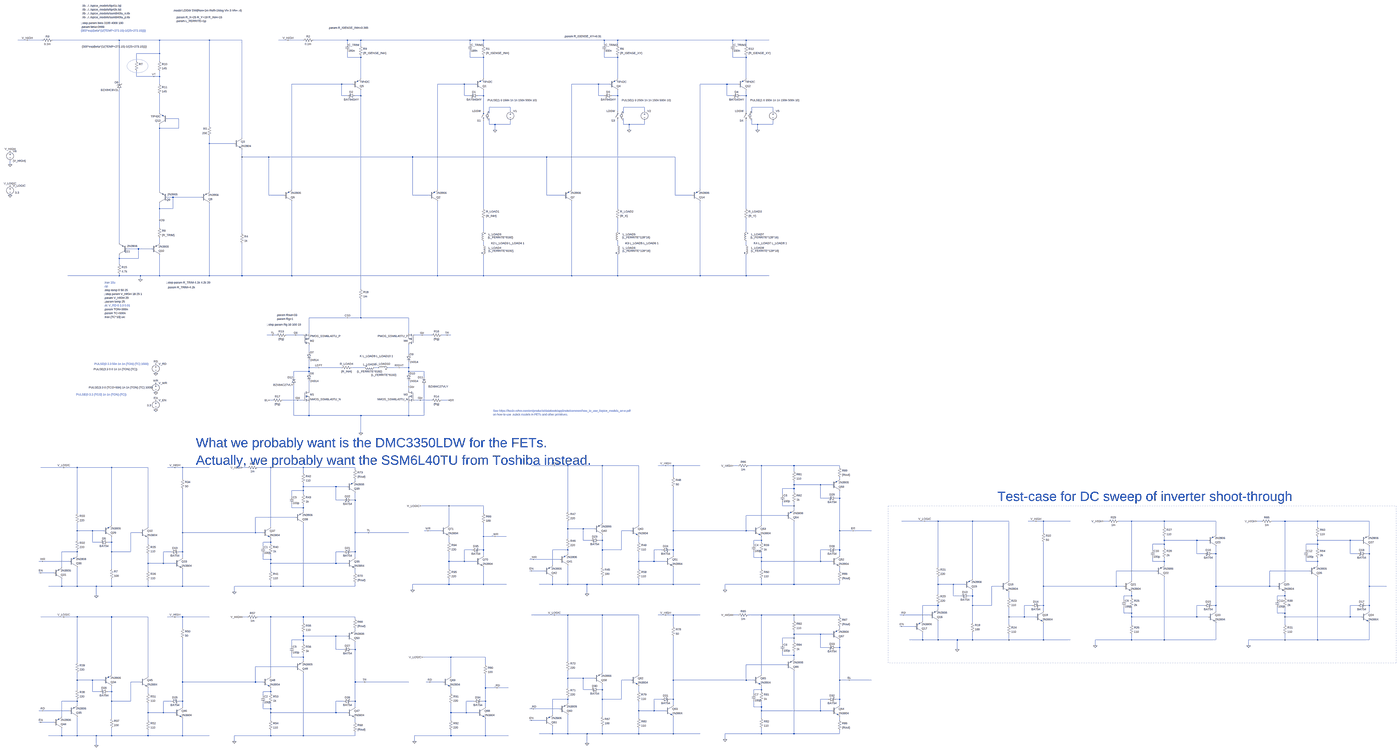
[diagram p0: schematic line_switch_new2.asc, whole sheet]
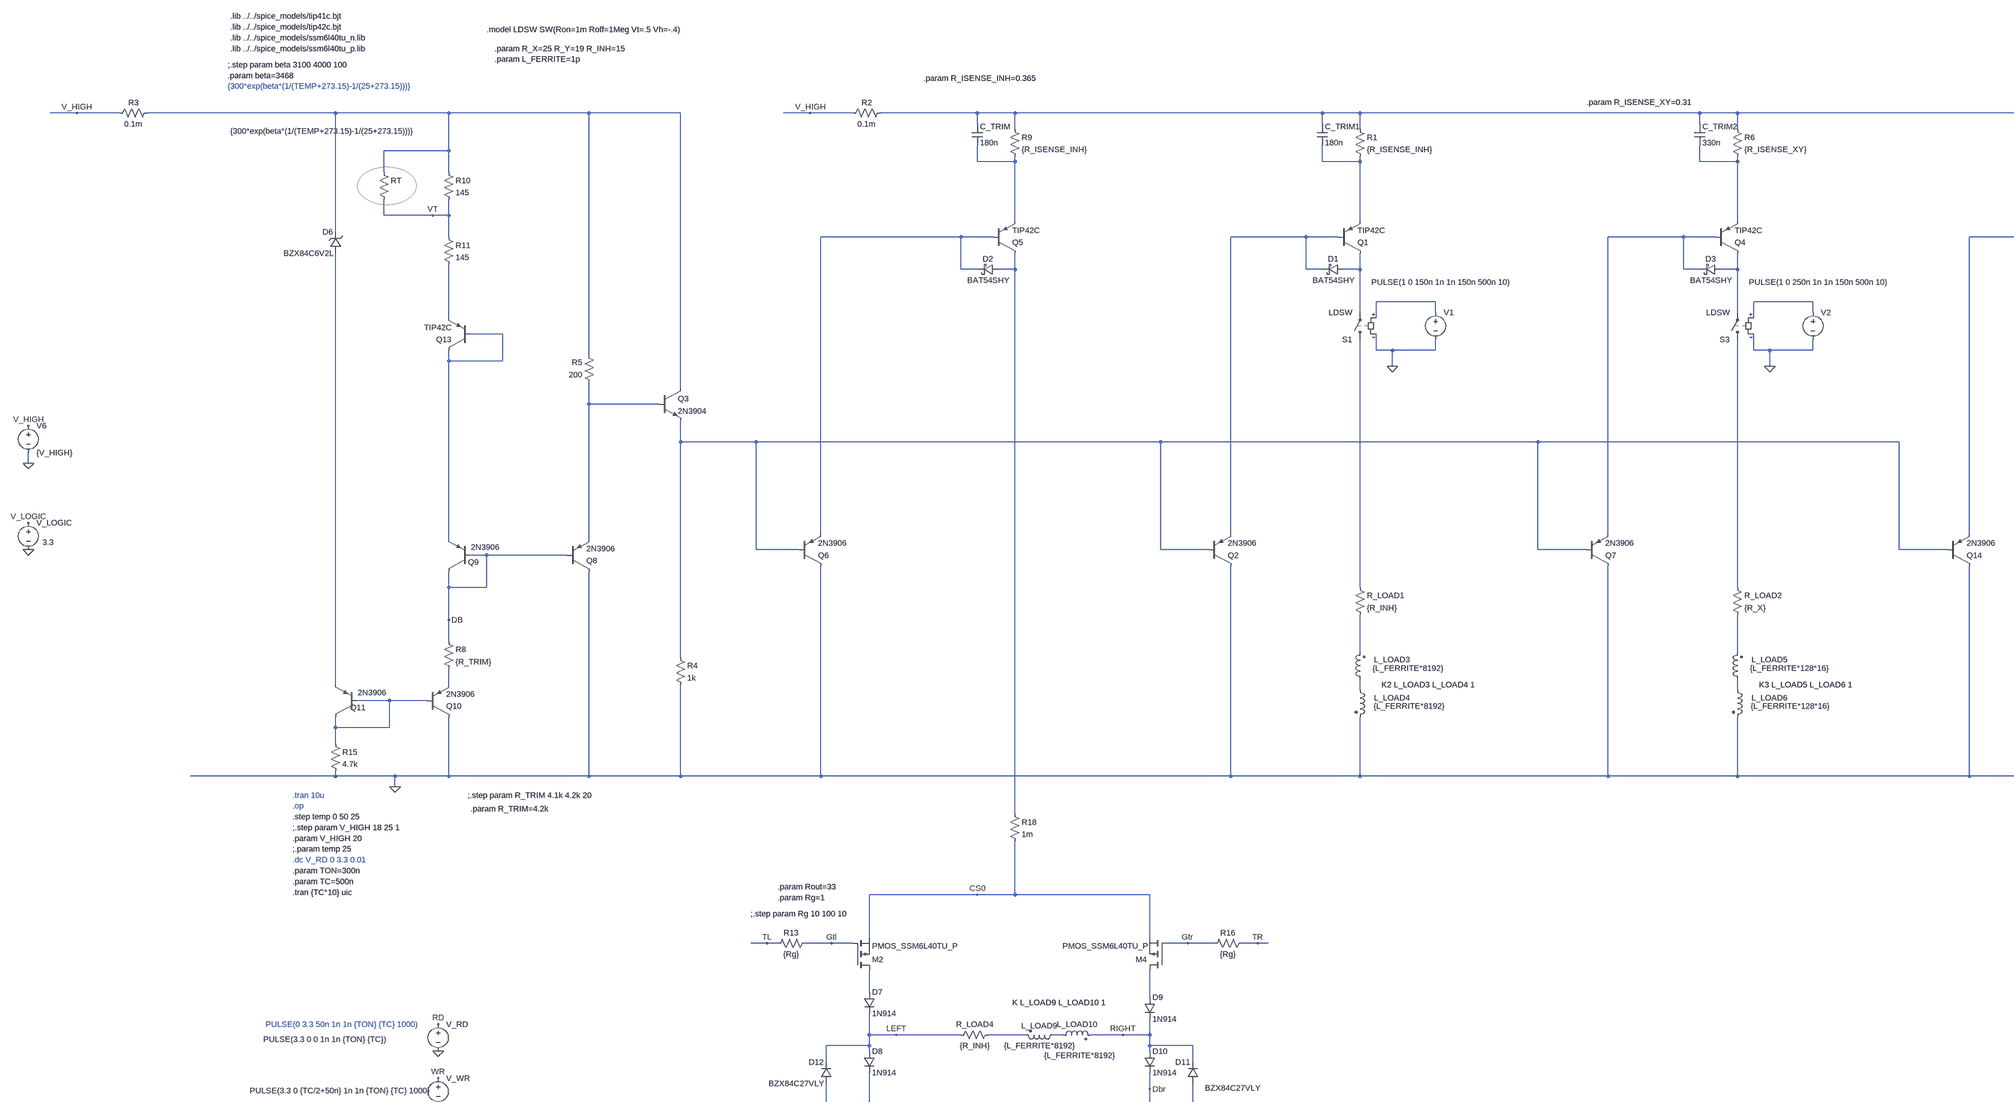
[diagram p1: schematic line_switch_new2.asc, part, row 1 of 2, column 1 of 2]
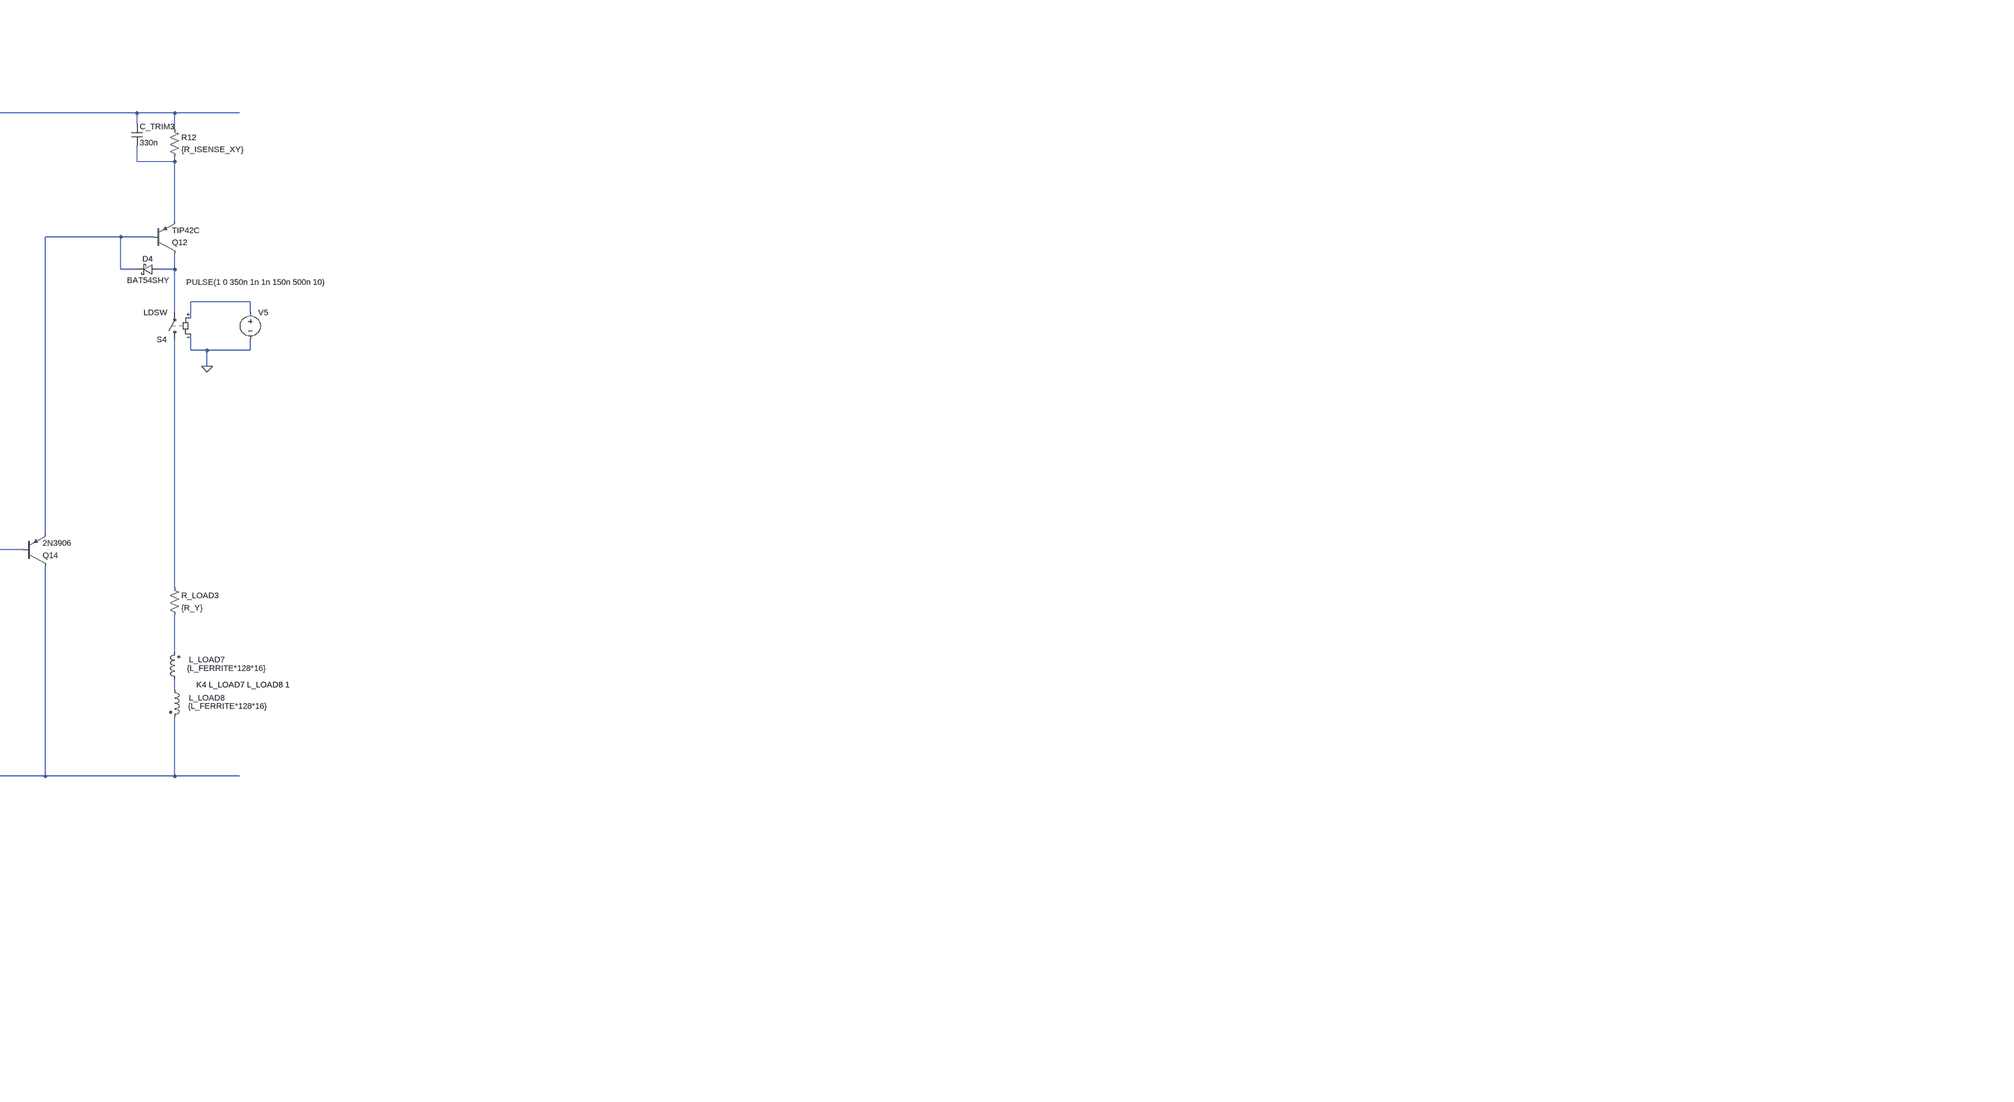
[diagram p2: schematic line_switch_new2.asc, part, row 1 of 2, column 2 of 2]
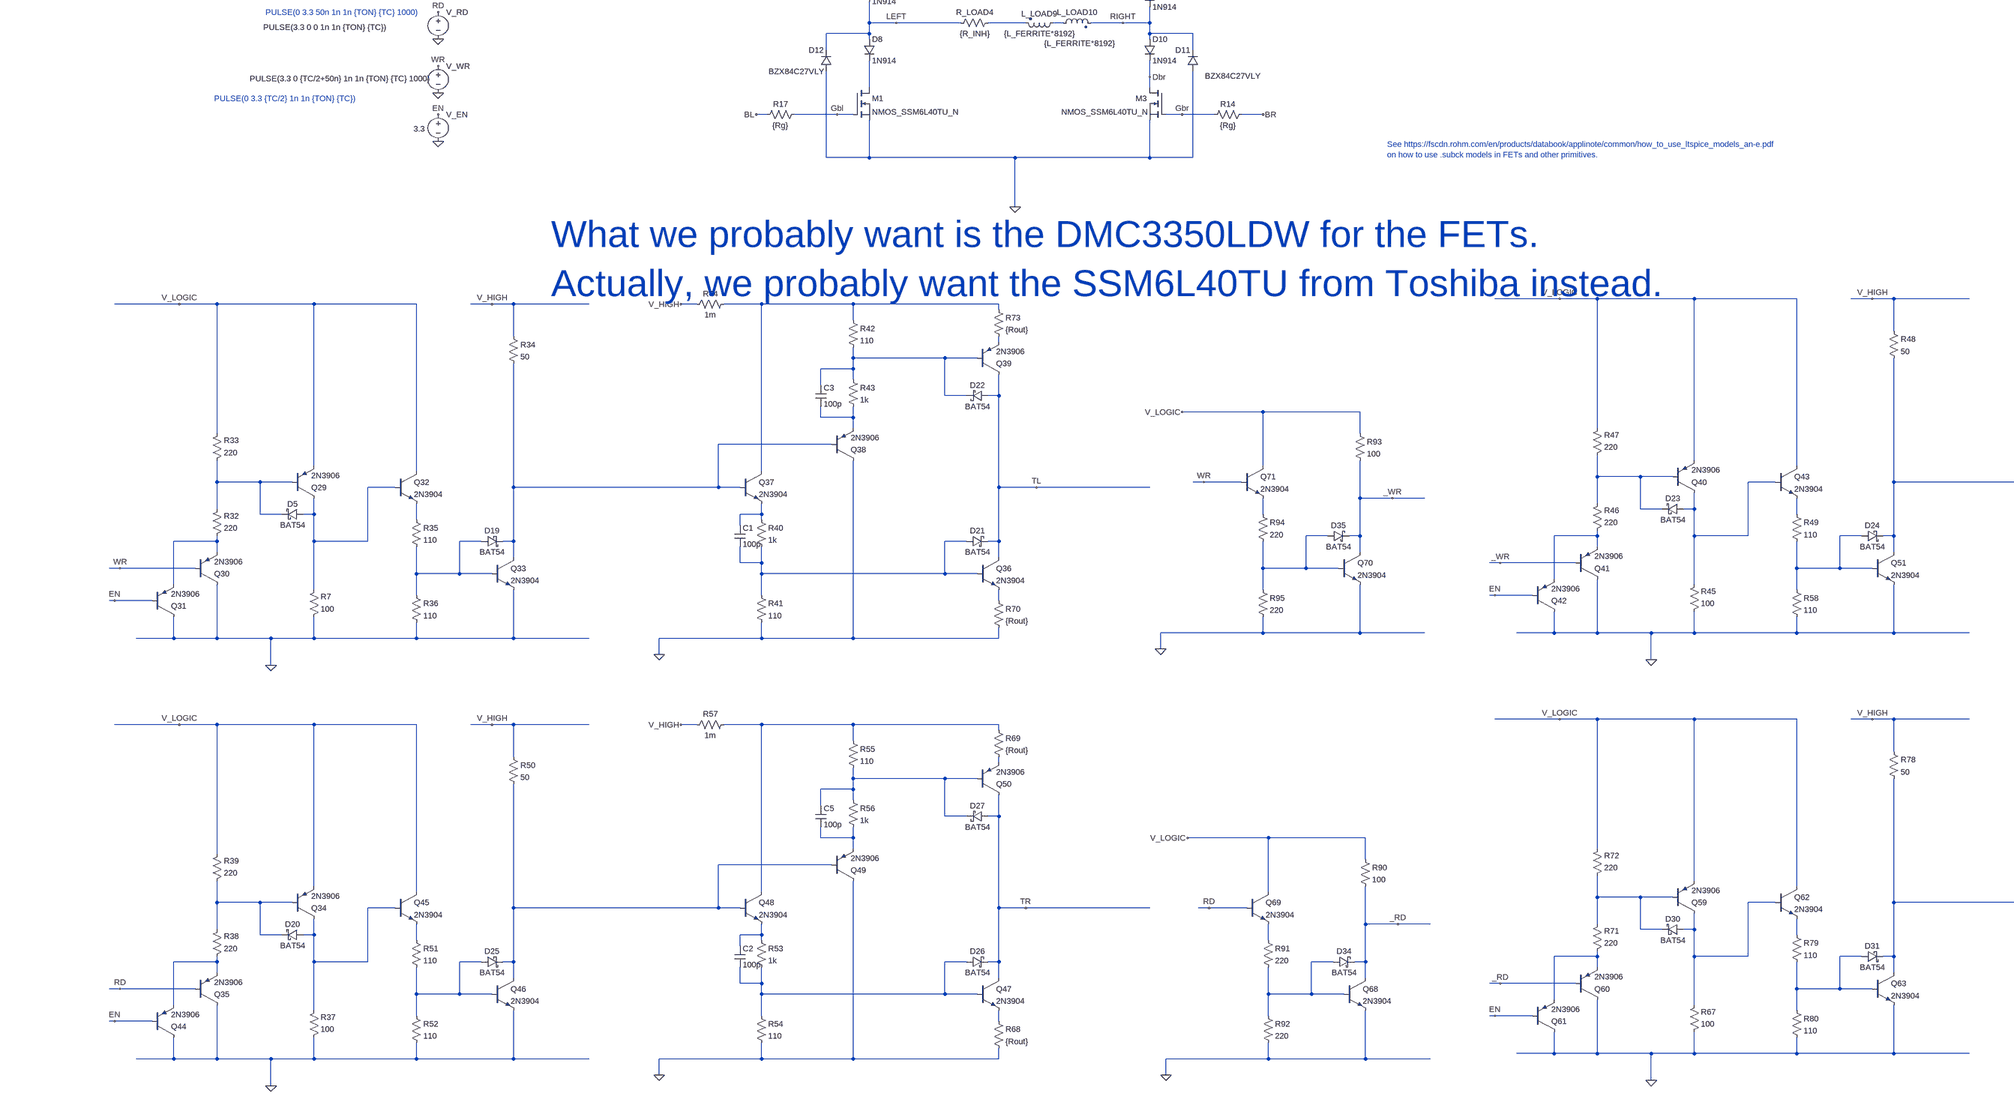
[diagram p3: schematic line_switch_new2.asc, part, row 2 of 2, column 1 of 2]
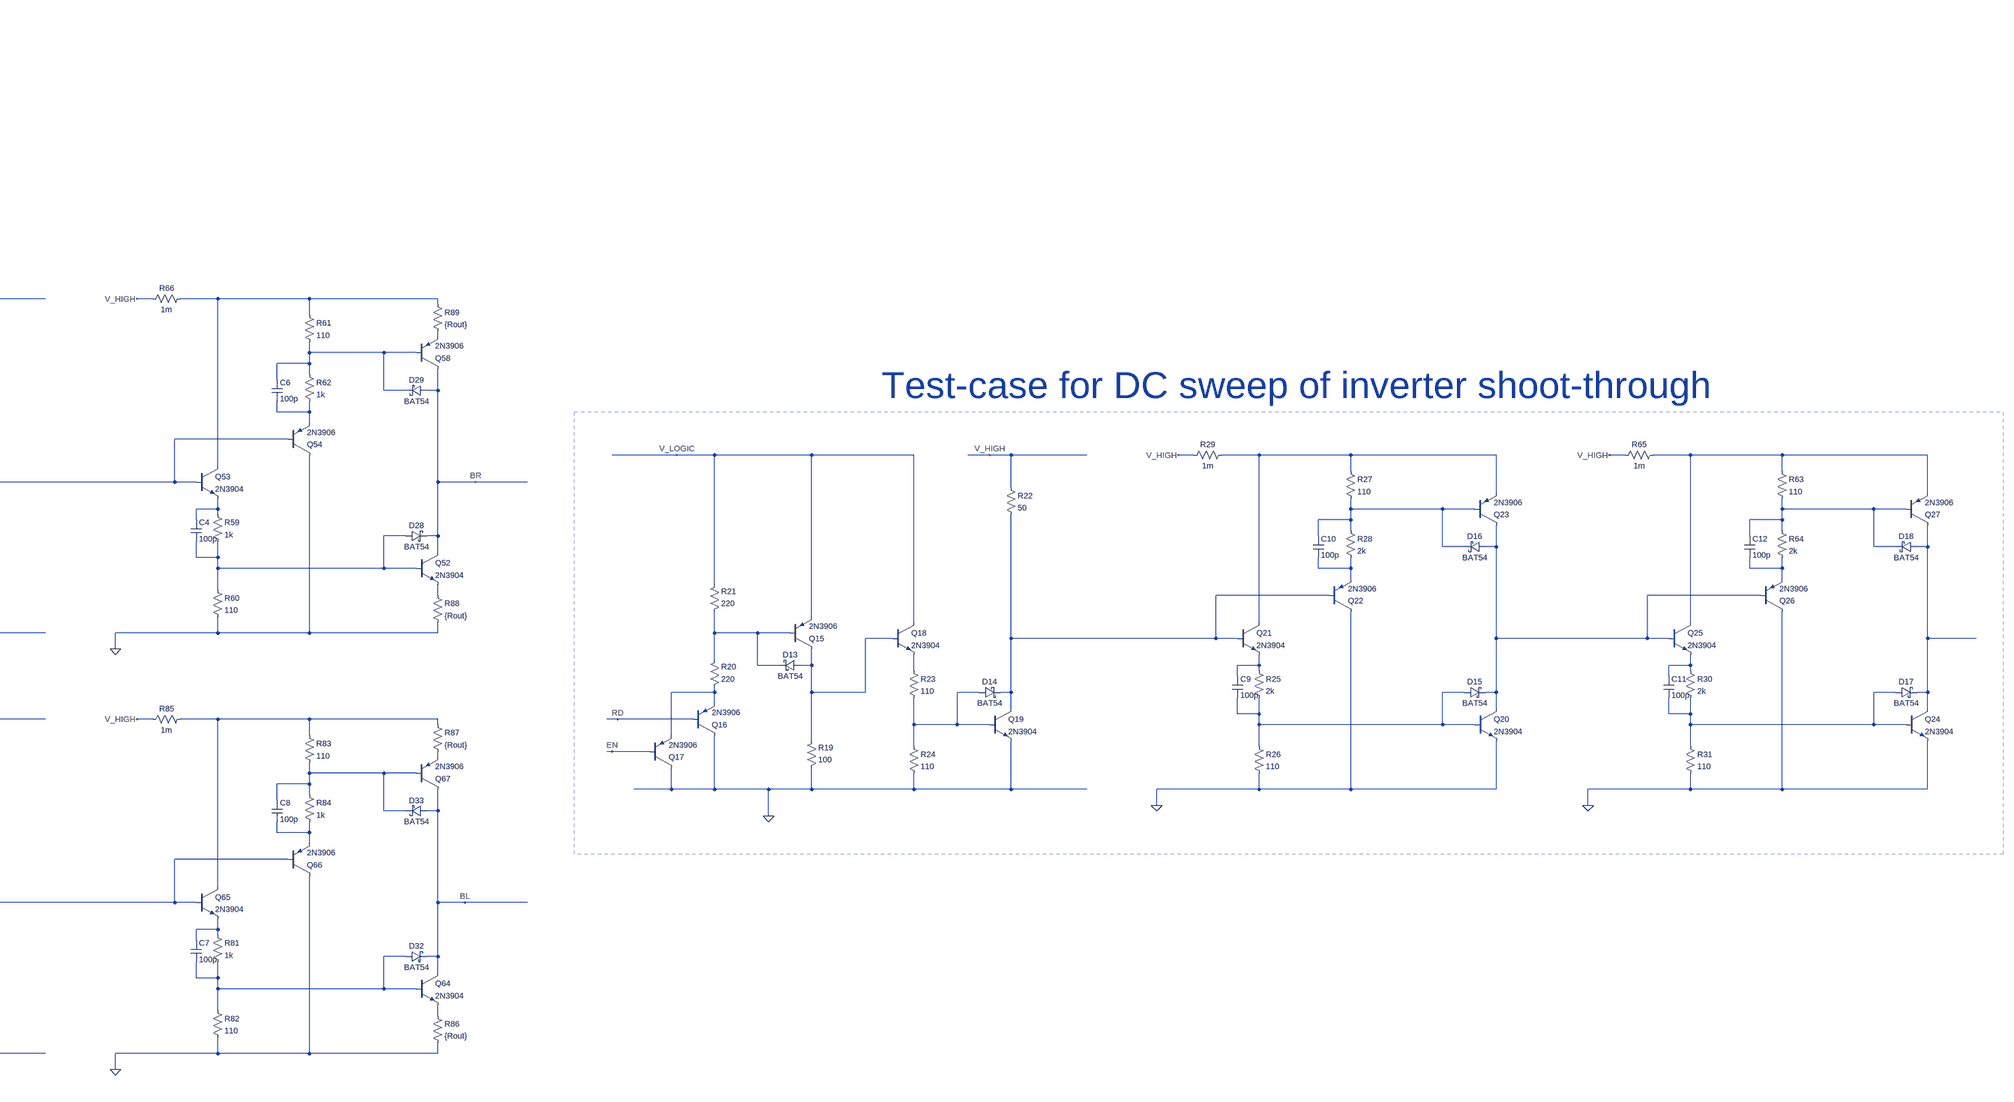
[diagram p4: schematic line_switch_new2.asc, part, row 2 of 2, column 2 of 2]
* line_switch_new2.asc
R8 DB N029 {R_TRIM}
R9 N002 N003 {R_ISENSE_INH}
Q5 N011 N007 N003 0 TIP42C
Q8 0 DB N020 0 2N3906
Q9 DB DB N019 0 2N3906
R10 N001 VT 145
R11 VT N018 145
RT N001 VT {300*exp(beta*(1/(TEMP+273.15)-1/(25+273.15)))}
D2 N011 N007 BAT54SHY
C_TRIM N002 N003 180n
D6 N028 N001 BZX84C6V2L
R15 N033 0 4.7k
Q10 0 N033 N029 0 2N3906
Q11 N033 N033 N028 0 2N3906
R1 N002 N004 {R_ISENSE_INH}
Q1 N012 N008 N004 0 TIP42C
Q2 0 N021 N008 0 2N3906
D1 N012 N008 BAT54SHY
C_TRIM1 N002 N004 180n
S1 N022 N012 N015 0 LDSW
V1 N015 0 PULSE(1 0 150n 1n 1n 150n 500n 10)
R_LOAD1 N022 N025 {R_INH}
L_LOAD3 N030 N025 {L_FERRITE*8192}
L_LOAD4 N030 0 {L_FERRITE*8192}
Q3 N001 N020 N021 0 2N3904
Q6 0 N021 N007 0 2N3906
R4 N021 0 1k
Q13 N019 N019 N018 0 TIP42C
R5 N020 N001 200
R6 N002 N005 {R_ISENSE_XY}
Q4 N013 N009 N005 0 TIP42C
Q7 0 N021 N009 0 2N3906
D3 N013 N009 BAT54SHY
C_TRIM2 N002 N005 330n
S3 N023 N013 N016 0 LDSW
V2 N016 0 PULSE(1 0 250n 1n 1n 150n 500n 10)
R_LOAD2 N023 N026 {R_X}
L_LOAD5 N031 N026 {L_FERRITE*128*16}
L_LOAD6 N031 0 {L_FERRITE*128*16}
R12 N002 N006 {R_ISENSE_XY}
Q12 N014 N010 N006 0 TIP42C
Q14 0 N021 N010 0 2N3906
D4 N014 N010 BAT54SHY
C_TRIM3 N002 N006 330n
S4 N024 N014 N017 0 LDSW
V5 N017 0 PULSE(1 0 350n 1n 1n 150n 500n 10)
R_LOAD3 N024 N027 {R_Y}
L_LOAD7 N032 N027 {L_FERRITE*128*16}
L_LOAD8 N032 0 {L_FERRITE*128*16}
R2 V_HIGH N002 0.1m
R3 V_HIGH N001 0.1m
V6 V_HIGH 0 {V_HIGH}
X§M1 N038 Gbl 0 NMOS_SSM6L40TU_N  ; pins D G S
X§M2 N034 Gtl CS0 PMOS_SSM6L40TU_P  ; pins D G S
D7 N034 LEFT 1N914
D8 LEFT N038 1N914
D9 N035 RIGHT 1N914
D10 RIGHT Dbr 1N914
D11 0 RIGHT BZX84C27VLY
D12 0 LEFT BZX84C27VLY
V_WR WR 0 PULSE(3.3 0 {TC/2+50n} 1n 1n {TON} {TC} 1000)
V_RD RD 0 PULSE(3.3 0 0 1n 1n {TON} {TC})
V_EN EN 0 3.3
R_LOAD4 LEFT N036 {R_INH}
L_LOAD9 N037 N036 {L_FERRITE*8192}
L_LOAD10 N037 RIGHT {L_FERRITE*8192}
V_LOGIC V_LOGIC 0 3.3
D5 N054 N052 BAT54
R7 0 N054 100
R32 N066 N052 220
R33 N052 V_LOGIC 220
Q29 N054 N052 V_LOGIC 0 2N3906
Q30 0 WR N066 0 2N3906
Q31 0 EN N066 0 2N3906
D19 N067 N048 BAT54
R34 V_HIGH N048 50
R35 N061 N067 110
R36 N067 0 110
Q32 V_LOGIC N054 N061 0 2N3904
Q33 N048 N067 0 0 2N3904
Q36 TL N068 N075 0 2N3904
D21 N068 TL BAT54
Q37 N040 N048 N058 0 2N3904
R40 N058 N068 1k
R41 N068 0 110
C1 N058 N068 100p
Q38 0 N048 N046 0 2N3906
R42 N040 N044 110
R43 N044 N046 1k
C3 N044 N046 100p
D22 TL N044 BAT54
Q39 TL N044 N042 0 2N3906
R44 V_HIGH N040 1m
D20 N098 N096 BAT54
R37 0 N098 100
R38 N107 N096 220
R39 N096 V_LOGIC 220
Q34 N098 N096 V_LOGIC 0 2N3906
Q35 0 RD N107 0 2N3906
Q44 0 EN N107 0 2N3906
D25 N108 N094 BAT54
R50 V_HIGH N094 50
R51 N102 N108 110
R52 N108 0 110
Q45 V_LOGIC N098 N102 0 2N3904
Q46 N094 N108 0 0 2N3904
Q47 TR N109 N112 0 2N3904
D26 N109 TR BAT54
Q48 N086 N094 N100 0 2N3904
R53 N100 N109 1k
R54 N109 0 110
C2 N100 N109 100p
Q49 0 N094 N092 0 2N3906
R55 N086 N090 110
R56 N090 N092 1k
C5 N090 N092 100p
D27 TR N090 BAT54
Q50 TR N090 N088 0 2N3906
R57 V_HIGH N086 1m
R13 Gtl TL {Rg}
R14 BR Gbr {Rg}
R16 TR Gtr {Rg}
R17 Gbl BL {Rg}
R18 N011 CS0 1m
D13 N077 N076 BAT54
R19 0 N077 100
R20 N081 N076 220
R21 N076 V_LOGIC 220
Q15 N077 N076 V_LOGIC 0 2N3906
Q16 0 RD N081 0 2N3906
Q17 0 EN N081 0 2N3906
D14 N082 N074 BAT54
R22 V_HIGH N074 50
R23 N080 N082 110
R24 N082 0 110
Q18 V_LOGIC N077 N080 0 2N3904
Q19 N074 N082 0 0 2N3904
Q20 N069 N083 0 0 2N3904
D15 N083 N069 BAT54
Q21 N049 N074 N078 0 2N3904
R25 N078 N083 2k
R26 N083 0 110
C9 N078 N083 100p
Q22 0 N074 N071 0 2N3906
R27 N049 N056 110
R28 N056 N071 2k
C10 N056 N071 100p
D16 N069 N056 BAT54
Q23 N069 N056 N049 0 2N3906
R29 V_HIGH N049 1m
Q24 N070 N084 0 0 2N3904
D17 N084 N070 BAT54
Q25 N050 N069 N079 0 2N3904
R30 N079 N084 2k
R31 N084 0 110
C11 N079 N084 100p
Q26 0 N069 N072 0 2N3906
R63 N050 N057 110
R64 N057 N072 2k
C12 N057 N072 100p
D18 N070 N057 BAT54
Q27 N070 N057 N050 0 2N3906
R65 V_HIGH N050 1m
R68 N112 0 {Rout}
R69 N086 N088 {Rout}
R70 N075 0 {Rout}
R73 N040 N042 {Rout}
D23 N053 N051 BAT54
R45 0 N053 100
R46 N063 N051 220
R47 N051 V_LOGIC 220
Q40 N053 N051 V_LOGIC 0 2N3906
Q41 0 _WR N063 0 2N3906
Q42 0 EN N063 0 2N3906
D24 N064 N047 BAT54
R48 V_HIGH N047 50
R49 N060 N064 110
R58 N064 0 110
Q43 V_LOGIC N053 N060 0 2N3904
Q51 N047 N064 0 0 2N3904
Q52 BR N065 N073 0 2N3904
D28 N065 BR BAT54
Q53 N039 N047 N055 0 2N3904
R59 N055 N065 1k
R60 N065 0 110
C4 N055 N065 100p
Q54 0 N047 N045 0 2N3906
R61 N039 N043 110
R62 N043 N045 1k
C6 N043 N045 100p
D29 BR N043 BAT54
Q58 BR N043 N041 0 2N3906
R66 V_HIGH N039 1m
D30 N097 N095 BAT54
R67 0 N097 100
R71 N104 N095 220
R72 N095 V_LOGIC 220
Q59 N097 N095 V_LOGIC 0 2N3906
Q60 0 _RD N104 0 2N3906
Q61 0 EN N104 0 2N3906
D31 N105 N093 BAT54
R78 V_HIGH N093 50
R79 N101 N105 110
R80 N105 0 110
Q62 V_LOGIC N097 N101 0 2N3904
Q63 N093 N105 0 0 2N3904
Q64 BL N106 N111 0 2N3904
D32 N106 BL BAT54
Q65 N085 N093 N099 0 2N3904
R81 N099 N106 1k
R82 N106 0 110
C7 N099 N106 100p
Q66 0 N093 N091 0 2N3906
R83 N085 N089 110
R84 N089 N091 1k
C8 N089 N091 100p
D33 BL N089 BAT54
Q67 BL N089 N087 0 2N3906
R85 V_HIGH N085 1m
R86 N111 0 {Rout}
R87 N085 N087 {Rout}
R88 N073 0 {Rout}
R89 N039 N041 {Rout}
Q68 _RD N110 0 0 2N3904
D34 N110 _RD BAT54
Q69 V_LOGIC RD N103 0 2N3904
R90 V_LOGIC _RD 100
R91 N103 N110 220
R92 N110 0 220
Q70 _WR N062 0 0 2N3904
D35 N062 _WR BAT54
Q71 V_LOGIC WR N059 0 2N3904
R93 V_LOGIC _WR 100
R94 N059 N062 220
R95 N062 0 220
X§M3 Dbr Gbr 0 NMOS_SSM6L40TU_N  ; pins D G S
X§M4 N035 Gtr CS0 PMOS_SSM6L40TU_P  ; pins D G S
.model D D
.lib standard.dio
.model NPN NPN
.model PNP PNP
.lib standard.bjt
.lib ../../spice_models/tip42c.bjt
.lib ../../spice_models/tip41c.bjt
.step temp 0 50 25
* .op
;.step param V_HIGH 18 25 1
.param beta=3468
;.step param beta 3100 4000 100
* {300*exp(beta*(1/(TEMP+273.15)-1/(25+273.15)))}
.param L_FERRITE=1p
.param R_X=25 R_Y=19 R_INH=15
.param R_ISENSE_INH=0.365
;.step param R_TRIM 4.1k 4.2k 20
.param R_TRIM=4.2k
.param V_HIGH 20
;.param temp 25
.model LDSW SW(Ron=1m Roff=1Meg Vt=.5 Vh=-.4)
* .tran 10u
K2 L_LOAD3 L_LOAD4 1
K3 L_LOAD5 L_LOAD6 1
K4 L_LOAD7 L_LOAD8 1
.param R_ISENSE_XY=0.31
.tran {TC*10} uic
.param TON=300n
.param TC=500n
K L_LOAD9 L_LOAD10 1
.param Rg=1
;.step param Rg 10 100 10
* .dc V_RD 0 3.3 0.01
* Test-case for DC sweep of inverter shoot-through
.param Rout=33
* PULSE(0 3.3 {TC/2} 1n 1n {TON} {TC})
* PULSE(0 3.3 50n 1n 1n {TON} {TC} 1000)
* What we probably want is the DMC3350LDW for the FETs.
* Actually, we probably want the SSM6L40TU from Toshiba instead.
.lib ../../spice_models/ssm6l40tu_n.lib
.lib ../../spice_models/ssm6l40tu_p.lib
* See https://fscdn.rohm.com/en/products/databook/applinote/common/how_to_use_ltspice_models_an-e.pdf
* on how to use .subck models in FETs and other primitives.
.backanno
.end